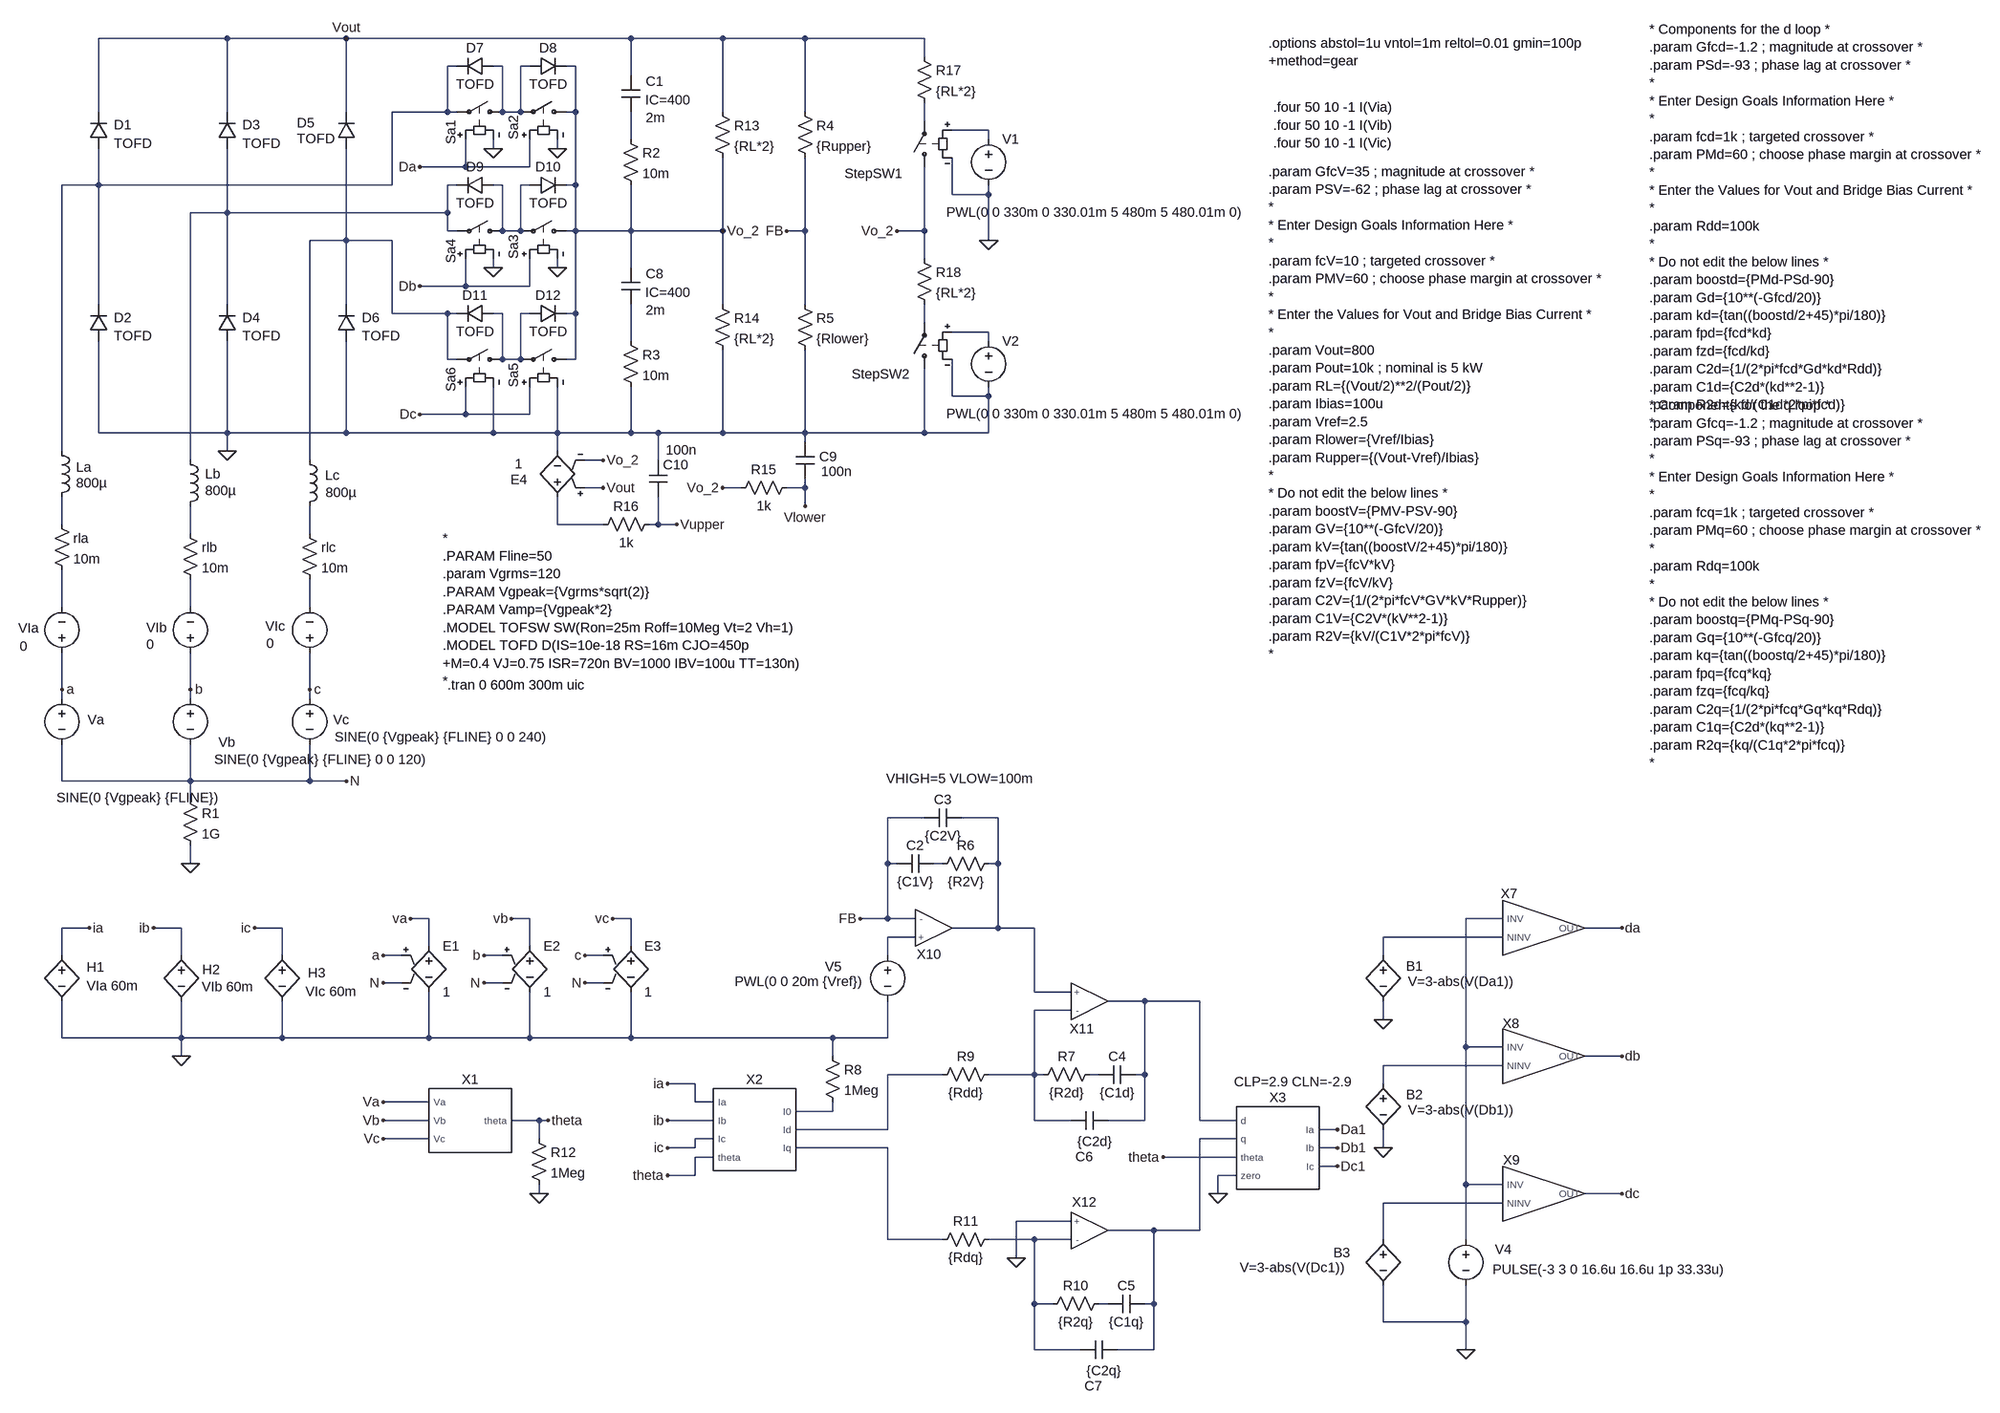
[diagram p0: schematic 3-phase Vienna PFC with switches - load step.asc]
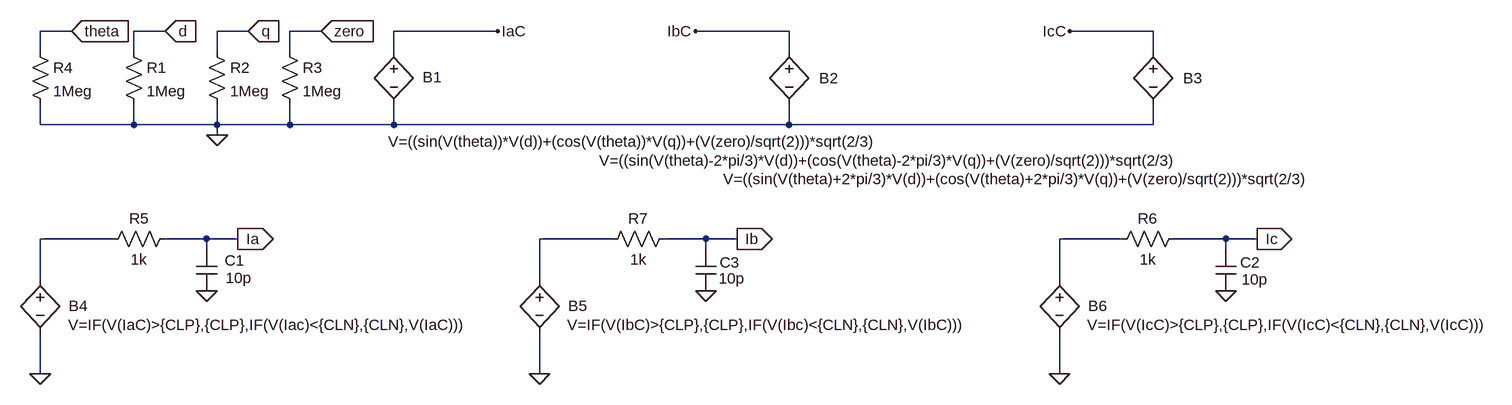
[diagram p1: sub-circuit inverse_dq0.asc]
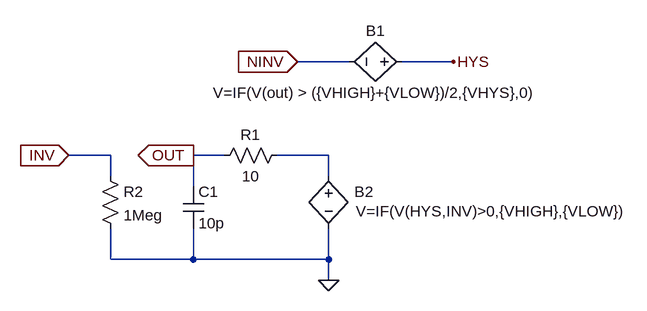
[diagram p2: sub-circuit comptof.asc]
3-phase Vienna PFC with switches - load step.asc, the LTspice schematic file:
Version 4
SHEET 1 4316 2068
WIRE 464 -960 240 -960
WIRE 672 -960 464 -960
WIRE 1168 -960 672 -960
WIRE 1328 -960 1168 -960
WIRE 1472 -960 1328 -960
WIRE 1680 -960 1472 -960
WIRE 1680 -928 1680 -960
WIRE 864 -912 848 -912
WIRE 944 -912 928 -912
WIRE 992 -912 976 -912
WIRE 1072 -912 1056 -912
WIRE 1168 -896 1168 -960
WIRE 240 -832 240 -960
WIRE 464 -832 464 -960
WIRE 672 -832 672 -960
WIRE 848 -832 848 -912
WIRE 848 -832 752 -832
WIRE 864 -832 848 -832
WIRE 944 -832 944 -912
WIRE 976 -832 976 -912
WIRE 976 -832 944 -832
WIRE 1072 -832 1072 -912
WIRE 1072 -832 1056 -832
WIRE 1328 -832 1328 -960
WIRE 1472 -832 1472 -960
WIRE 1680 -816 1680 -848
WIRE 1792 -800 1728 -800
WIRE 1168 -784 1168 -832
WIRE 1792 -784 1792 -800
WIRE 928 -768 928 -784
WIRE 1040 -768 1040 -784
WIRE 880 -736 880 -784
WIRE 880 -736 800 -736
WIRE 992 -736 992 -784
WIRE 992 -736 880 -736
WIRE 240 -704 240 -768
WIRE 240 -704 176 -704
WIRE 752 -704 752 -832
WIRE 752 -704 240 -704
WIRE 864 -704 848 -704
WIRE 944 -704 928 -704
WIRE 992 -704 976 -704
WIRE 1072 -704 1072 -832
WIRE 1072 -704 1056 -704
WIRE 1728 -688 1728 -752
WIRE 1792 -688 1792 -704
WIRE 1792 -688 1728 -688
WIRE 464 -656 464 -768
WIRE 464 -656 400 -656
WIRE 848 -656 848 -704
WIRE 848 -656 464 -656
WIRE 848 -624 848 -656
WIRE 864 -624 848 -624
WIRE 944 -624 944 -704
WIRE 976 -624 976 -704
WIRE 976 -624 944 -624
WIRE 1072 -624 1072 -704
WIRE 1072 -624 1056 -624
WIRE 1168 -624 1168 -704
WIRE 1168 -624 1072 -624
WIRE 1328 -624 1328 -752
WIRE 1328 -624 1168 -624
WIRE 1472 -624 1472 -752
WIRE 1472 -624 1440 -624
WIRE 1680 -624 1680 -736
WIRE 1680 -624 1632 -624
WIRE 672 -608 672 -768
WIRE 672 -608 608 -608
WIRE 752 -608 672 -608
WIRE 1792 -608 1792 -688
WIRE 1680 -576 1680 -624
WIRE 928 -560 928 -576
WIRE 1040 -560 1040 -576
WIRE 1168 -560 1168 -624
WIRE 880 -528 880 -576
WIRE 880 -528 800 -528
WIRE 992 -528 992 -576
WIRE 992 -528 880 -528
WIRE 240 -496 240 -704
WIRE 464 -496 464 -656
WIRE 672 -496 672 -608
WIRE 1328 -496 1328 -624
WIRE 1472 -496 1472 -624
WIRE 752 -480 752 -608
WIRE 848 -480 752 -480
WIRE 864 -480 848 -480
WIRE 944 -480 928 -480
WIRE 992 -480 976 -480
WIRE 1072 -480 1072 -624
WIRE 1072 -480 1056 -480
WIRE 1680 -464 1680 -496
WIRE 1792 -448 1728 -448
WIRE 1168 -432 1168 -496
WIRE 1792 -432 1792 -448
WIRE 848 -400 848 -480
WIRE 864 -400 848 -400
WIRE 944 -400 944 -480
WIRE 976 -400 976 -480
WIRE 976 -400 944 -400
WIRE 1072 -400 1072 -480
WIRE 1072 -400 1056 -400
WIRE 1728 -336 1728 -400
WIRE 1792 -336 1792 -352
WIRE 1792 -336 1728 -336
WIRE 880 -304 880 -352
WIRE 880 -304 800 -304
WIRE 992 -304 992 -352
WIRE 992 -304 880 -304
WIRE 240 -272 240 -432
WIRE 464 -272 464 -432
WIRE 464 -272 240 -272
WIRE 672 -272 672 -432
WIRE 672 -272 464 -272
WIRE 928 -272 928 -352
WIRE 928 -272 672 -272
WIRE 1040 -272 1040 -352
WIRE 1040 -272 928 -272
WIRE 1168 -272 1168 -352
WIRE 1168 -272 1040 -272
WIRE 1216 -272 1168 -272
WIRE 1328 -272 1328 -416
WIRE 1328 -272 1216 -272
WIRE 1472 -272 1472 -416
WIRE 1472 -272 1328 -272
WIRE 1680 -272 1680 -384
WIRE 1680 -272 1472 -272
WIRE 1792 -272 1792 -336
WIRE 1792 -272 1680 -272
WIRE 1472 -256 1472 -272
WIRE 176 -240 176 -704
WIRE 464 -240 464 -272
WIRE 1040 -240 1040 -272
WIRE 400 -224 400 -656
WIRE 608 -224 608 -608
WIRE 1120 -224 1088 -224
WIRE 1216 -224 1216 -272
WIRE 1120 -176 1088 -176
WIRE 1360 -176 1328 -176
WIRE 1472 -176 1472 -192
WIRE 1472 -176 1440 -176
WIRE 1472 -144 1472 -176
WIRE 176 -112 176 -160
WIRE 1040 -112 1040 -160
WIRE 1120 -112 1040 -112
WIRE 1216 -112 1216 -160
WIRE 1216 -112 1200 -112
WIRE 1248 -112 1216 -112
WIRE 400 -96 400 -144
WIRE 608 -96 608 -144
WIRE 176 32 176 -32
WIRE 400 32 400 -16
WIRE 608 32 608 -16
WIRE 176 176 176 112
WIRE 400 176 400 112
WIRE 608 176 608 112
WIRE 176 192 176 176
WIRE 400 192 400 176
WIRE 608 192 608 176
WIRE 176 336 176 272
WIRE 400 336 400 272
WIRE 400 336 176 336
WIRE 608 336 608 272
WIRE 608 336 400 336
WIRE 672 336 608 336
WIRE 400 368 400 336
WIRE 1680 400 1616 400
WIRE 1808 400 1744 400
WIRE 400 480 400 448
WIRE 1616 480 1616 400
WIRE 1632 480 1616 480
WIRE 1712 480 1696 480
WIRE 1808 480 1808 400
WIRE 1808 480 1792 480
WIRE 816 576 784 576
WIRE 992 576 960 576
WIRE 1168 576 1136 576
WIRE 1616 576 1616 480
WIRE 1616 576 1568 576
WIRE 1664 576 1616 576
WIRE 2688 576 2624 576
WIRE 224 592 176 592
WIRE 384 592 336 592
WIRE 560 592 512 592
WIRE 1808 592 1808 480
WIRE 1808 592 1728 592
WIRE 1872 592 1808 592
WIRE 2896 592 2832 592
WIRE 1664 608 1616 608
WIRE 2688 608 2480 608
WIRE 816 624 816 576
WIRE 992 624 992 576
WIRE 1168 624 1168 576
WIRE 176 640 176 592
WIRE 384 640 384 592
WIRE 560 640 560 592
WIRE 768 640 736 640
WIRE 944 640 912 640
WIRE 1120 640 1088 640
WIRE 1616 640 1616 608
WIRE 2480 640 2480 608
WIRE 768 688 736 688
WIRE 944 688 912 688
WIRE 1120 688 1088 688
WIRE 1872 704 1872 592
WIRE 1936 704 1872 704
WIRE 2064 720 2000 720
WIRE 2160 720 2064 720
WIRE 1936 736 1872 736
WIRE 2480 752 2480 720
WIRE 176 784 176 720
WIRE 384 784 384 720
WIRE 384 784 176 784
WIRE 560 784 560 720
WIRE 560 784 384 784
WIRE 816 784 816 704
WIRE 816 784 560 784
WIRE 992 784 992 704
WIRE 992 784 816 784
WIRE 1168 784 1168 704
WIRE 1168 784 992 784
WIRE 1520 784 1168 784
WIRE 1616 784 1616 720
WIRE 1616 784 1520 784
WIRE 2624 800 2624 576
WIRE 2688 800 2624 800
WIRE 384 816 384 784
WIRE 1520 816 1520 784
WIRE 2896 816 2832 816
WIRE 2688 832 2480 832
WIRE 1712 848 1616 848
WIRE 1872 848 1872 736
WIRE 1872 848 1792 848
WIRE 1888 848 1872 848
WIRE 1984 848 1968 848
WIRE 2064 848 2064 720
WIRE 2064 848 2048 848
WIRE 1280 864 1232 864
WIRE 2480 864 2480 832
WIRE 816 896 736 896
WIRE 1280 896 1280 864
WIRE 1312 896 1280 896
WIRE 1520 912 1520 896
WIRE 1520 912 1456 912
WIRE 816 928 736 928
WIRE 1008 928 960 928
WIRE 1024 928 1008 928
WIRE 1312 928 1232 928
WIRE 1872 928 1872 848
WIRE 1936 928 1872 928
WIRE 2064 928 2064 848
WIRE 2064 928 2000 928
WIRE 2160 928 2160 720
WIRE 2224 928 2160 928
WIRE 1616 944 1616 848
WIRE 1616 944 1456 944
WIRE 2400 944 2368 944
WIRE 816 960 736 960
WIRE 1008 960 1008 928
WIRE 1312 960 1280 960
WIRE 2224 960 2160 960
WIRE 1280 976 1280 960
WIRE 1280 976 1232 976
WIRE 1616 976 1456 976
WIRE 2400 976 2368 976
WIRE 2480 976 2480 944
WIRE 1312 992 1280 992
WIRE 2224 992 2096 992
WIRE 2400 1008 2368 1008
WIRE 1280 1024 1280 992
WIRE 1280 1024 1232 1024
WIRE 2224 1024 2192 1024
WIRE 2624 1040 2624 800
WIRE 2688 1040 2624 1040
WIRE 1008 1056 1008 1040
WIRE 2192 1056 2192 1024
WIRE 2896 1056 2832 1056
WIRE 2688 1072 2480 1072
WIRE 1936 1104 1840 1104
WIRE 2080 1120 2000 1120
WIRE 2160 1120 2160 960
WIRE 2160 1120 2080 1120
WIRE 1616 1136 1616 976
WIRE 1712 1136 1616 1136
WIRE 1872 1136 1792 1136
WIRE 1936 1136 1872 1136
WIRE 2480 1136 2480 1072
WIRE 2624 1136 2624 1040
WIRE 1840 1168 1840 1104
WIRE 1872 1248 1872 1136
WIRE 1904 1248 1872 1248
WIRE 2000 1248 1984 1248
WIRE 2080 1248 2080 1120
WIRE 2080 1248 2064 1248
WIRE 2480 1280 2480 1216
WIRE 2624 1280 2624 1216
WIRE 2624 1280 2480 1280
WIRE 1872 1328 1872 1248
WIRE 1952 1328 1872 1328
WIRE 2080 1328 2080 1248
WIRE 2080 1328 2016 1328
WIRE 2624 1328 2624 1280
FLAG 400 480 0
FLAG 224 592 ia
FLAG 336 592 ib
FLAG 512 592 ic
FLAG 176 176 a
FLAG 400 176 b
FLAG 608 176 c
FLAG 384 816 0
FLAG 1440 -624 FB
FLAG 672 -960 Vout
FLAG 784 576 va
FLAG 672 336 N
FLAG 736 688 N
FLAG 736 640 a
FLAG 960 576 vb
FLAG 912 688 N
FLAG 912 640 b
FLAG 1136 576 vc
FLAG 1088 688 N
FLAG 1088 640 c
FLAG 464 -240 0
FLAG 1024 928 theta
FLAG 736 896 Va
FLAG 736 928 Vb
FLAG 736 960 Vc
FLAG 1232 864 ia
FLAG 1232 928 ib
FLAG 1232 976 ic
FLAG 1232 1024 theta
FLAG 1568 576 FB
FLAG 1840 1168 0
FLAG 2096 992 theta
FLAG 2192 1056 0
FLAG 2624 1328 0
FLAG 2896 592 da
FLAG 2896 816 db
FLAG 2896 1056 dc
FLAG 1008 1056 0
FLAG 928 -768 0
FLAG 1040 -768 0
FLAG 1040 -560 0
FLAG 928 -560 0
FLAG 800 -304 Dc
FLAG 800 -528 Db
FLAG 800 -736 Da
FLAG 1328 -624 Vo_2
FLAG 2400 944 Da1
FLAG 2400 976 Db1
FLAG 2400 1008 Dc1
FLAG 2480 752 0
FLAG 2480 976 0
FLAG 1328 -176 Vo_2
FLAG 1472 -144 Vlower
FLAG 1120 -224 Vo_2
FLAG 1120 -176 Vout
FLAG 1248 -112 Vupper
FLAG 1632 -624 Vo_2
FLAG 1792 -608 0
SYMBOL voltage 176 176 R0
WINDOW 0 45 53 Left 2
WINDOW 3 -9 189 Left 2
WINDOW 123 0 0 Left 0
WINDOW 39 0 0 Left 0
SYMATTR InstName Va
SYMATTR Value SINE(0 {Vgpeak} {FLINE})
SYMBOL voltage 400 176 R0
WINDOW 0 49 92 Left 2
WINDOW 3 42 122 Left 2
WINDOW 123 0 0 Left 0
WINDOW 39 0 0 Left 0
SYMATTR InstName Vb
SYMATTR Value SINE(0 {Vgpeak} {FLINE} 0 0 120)
SYMBOL voltage 608 176 R0
WINDOW 0 41 53 Left 2
WINDOW 3 44 83 Left 2
WINDOW 123 0 0 Left 0
WINDOW 39 0 0 Left 0
SYMATTR InstName Vc
SYMATTR Value SINE(0 {Vgpeak} {FLINE} 0 0 240)
SYMBOL res 384 352 R0
SYMATTR InstName R1
SYMATTR Value 1G
SYMBOL res 160 -128 R0
SYMATTR InstName rla
SYMATTR Value 10m
SYMBOL res 384 -112 R0
SYMATTR InstName rlb
SYMATTR Value 10m
SYMBOL res 592 -112 R0
SYMATTR InstName rlc
SYMATTR Value 10m
SYMBOL h 176 624 R0
WINDOW 0 43 37 Left 2
WINDOW 3 43 69 Left 2
SYMATTR InstName H1
SYMATTR Value VIa 60m
SYMBOL h 384 624 R0
WINDOW 0 37 41 Left 2
WINDOW 3 36 71 Left 2
SYMATTR InstName H2
SYMATTR Value VIb 60m
SYMBOL h 560 624 R0
WINDOW 0 45 47 Left 2
WINDOW 3 41 79 Left 2
SYMATTR InstName H3
SYMATTR Value VIc 60m
SYMBOL ind 160 -256 R0
WINDOW 0 41 44 Left 2
WINDOW 3 41 72 Left 2
SYMATTR InstName La
SYMATTR Value 800µ
SYMBOL ind 384 -240 R0
WINDOW 0 42 40 Left 2
WINDOW 3 42 69 Left 2
SYMATTR InstName Lb
SYMATTR Value 800µ
SYMBOL ind 592 -240 R0
WINDOW 0 43 42 Left 2
WINDOW 3 44 72 Left 2
SYMATTR InstName Lc
SYMATTR Value 800µ
SYMBOL voltage 176 128 R180
WINDOW 0 40 59 Left 2
WINDOW 3 60 27 Left 2
WINDOW 123 0 0 Left 0
WINDOW 39 0 0 Left 0
SYMATTR InstName VIa
SYMATTR Value 0
SYMBOL voltage 400 128 R180
WINDOW 0 41 60 Left 2
WINDOW 3 63 31 Left 2
WINDOW 123 0 0 Left 0
WINDOW 39 0 0 Left 0
SYMATTR InstName VIb
SYMATTR Value 0
SYMBOL voltage 608 128 R180
WINDOW 0 43 62 Left 2
WINDOW 3 62 32 Left 2
WINDOW 123 0 0 Left 0
WINDOW 39 0 0 Left 0
SYMATTR InstName VIc
SYMATTR Value 0
SYMBOL sw 1072 -832 M270
WINDOW 3 47 44 Invisible 2
WINDOW 0 -49 108 Left 2
SYMATTR Value TOFSW
SYMATTR InstName Sa2
SYMBOL sw 960 -832 M270
WINDOW 3 41 43 Invisible 2
WINDOW 0 -57 105 Left 2
SYMATTR Value TOFSW
SYMATTR InstName Sa1
SYMBOL cap 1152 -896 R0
WINDOW 0 42 11 Left 2
WINDOW 3 42 74 Left 2
WINDOW 123 41 43 Left 2
SYMATTR InstName C1
SYMATTR Value 2m
SYMATTR Value2 IC=400
SYMBOL res 1152 -800 R0
SYMATTR InstName R2
SYMATTR Value 10m
SYMBOL res 1456 -848 R0
SYMATTR InstName R4
SYMATTR Value {Rupper}
SYMBOL res 1456 -512 R0
SYMATTR InstName R5
SYMATTR Value {Rlower}
SYMBOL e 816 608 R0
SYMATTR InstName E1
SYMATTR Value 1
SYMBOL e 992 608 R0
SYMATTR InstName E2
SYMATTR Value 1
SYMBOL e 1168 608 R0
SYMATTR InstName E3
SYMATTR Value 1
SYMBOL theta_sub 880 928 R0
SYMATTR InstName X1
SYMBOL dq0_sub 1376 944 R0
SYMATTR InstName X2
SYMBOL res 1808 464 R90
WINDOW 0 0 56 VBottom 2
WINDOW 3 32 56 VTop 2
SYMATTR InstName R6
SYMATTR Value {R2V}
SYMBOL cap 1696 464 R90
WINDOW 0 0 32 VBottom 2
WINDOW 3 32 32 VTop 2
SYMATTR InstName C2
SYMATTR Value {C1V}
SYMBOL cap 1744 384 R90
WINDOW 0 0 32 VBottom 2
WINDOW 3 32 32 VTop 2
SYMATTR InstName C3
SYMATTR Value {C2V}
SYMBOL res 1872 864 R270
WINDOW 0 32 56 VTop 2
WINDOW 3 0 56 VBottom 2
SYMATTR InstName R7
SYMATTR Value {R2d}
SYMBOL cap 1984 864 R270
WINDOW 0 32 32 VTop 2
WINDOW 3 0 32 VBottom 2
SYMATTR InstName C4
SYMATTR Value {C1d}
SYMBOL cap 1936 944 R270
WINDOW 0 -63 23 VTop 2
WINDOW 3 -5 41 VBottom 2
SYMATTR InstName C6
SYMATTR Value {C2d}
SYMBOL res 1504 800 R0
SYMATTR InstName R8
SYMATTR Value 1Meg
SYMBOL res 1808 832 R90
WINDOW 0 0 56 VBottom 2
WINDOW 3 32 56 VTop 2
SYMATTR InstName R9
SYMATTR Value {Rdd}
SYMBOL res 1888 1264 R270
WINDOW 0 32 56 VTop 2
WINDOW 3 0 56 VBottom 2
SYMATTR InstName R10
SYMATTR Value {R2q}
SYMBOL cap 2000 1264 R270
WINDOW 0 32 32 VTop 2
WINDOW 3 0 32 VBottom 2
SYMATTR InstName C5
SYMATTR Value {C1q}
SYMBOL cap 1952 1344 R270
WINDOW 0 -63 23 VTop 2
WINDOW 3 -5 41 VBottom 2
SYMATTR InstName C7
SYMATTR Value {C2q}
SYMBOL res 1808 1120 R90
WINDOW 0 0 56 VBottom 2
WINDOW 3 32 56 VTop 2
SYMATTR InstName R11
SYMATTR Value {Rdq}
SYMBOL Inverse_dq0 2288 976 R0
WINDOW 39 35 -100 Bottom 2
SYMATTR SpiceLine CLP=2.9 CLN=-2.9
SYMATTR InstName X3
SYMBOL voltage 2624 1120 R0
WINDOW 123 0 0 Left 0
WINDOW 39 0 0 Left 0
WINDOW 0 51 33 Left 2
WINDOW 3 47 68 Left 2
SYMATTR InstName V4
SYMATTR Value PULSE(-3 3 0 16.6u 16.6u 1p 33.33u)
SYMBOL res 992 944 R0
SYMATTR InstName R12
SYMATTR Value 1Meg
SYMBOL COMPTOF 2752 592 R0
WINDOW 0 -52 -44 Bottom 2
SYMATTR InstName X7
SYMATTR SpiceLine VHIGH=5 VLOW=100m VHYS=10m
SYMBOL COMPTOF 2752 816 R0
WINDOW 0 -49 -41 Bottom 2
SYMATTR InstName X8
SYMATTR SpiceLine VHIGH=5 VLOW=100m VHYS=10m
SYMBOL COMPTOF 2752 1056 R0
WINDOW 0 -48 -43 Bottom 2
SYMATTR InstName X9
SYMATTR SpiceLine VHIGH=5 VLOW=100m VHYS=10m
SYMBOL opampTOF 1728 576 R0
WINDOW 0 -40 78 Bottom 2
WINDOW 39 13 -229 Bottom 2
SYMATTR InstName X10
SYMATTR SpiceLine VHIGH=5 VLOW=100m
SYMBOL opampTOF 2000 736 M180
WINDOW 0 -45 -17 Bottom 2
SYMATTR InstName X11
SYMATTR SpiceLine VHIGH=5 VLOW=-5
SYMBOL opampTOF 2000 1136 M180
WINDOW 0 -41 81 Bottom 2
SYMATTR InstName X12
SYMATTR SpiceLine VHIGH=5 VLOW=-5
SYMBOL res 1312 -848 R0
SYMATTR InstName R13
SYMATTR Value {RL*2}
SYMBOL diode 224 -768 M180
WINDOW 0 43 41 Left 2
WINDOW 3 43 9 Left 2
SYMATTR InstName D1
SYMATTR Value TOFD
SYMBOL diode 224 -432 M180
WINDOW 0 43 41 Left 2
WINDOW 3 43 9 Left 2
SYMATTR InstName D2
SYMATTR Value TOFD
SYMBOL diode 448 -768 M180
WINDOW 0 43 41 Left 2
WINDOW 3 43 9 Left 2
SYMATTR InstName D3
SYMATTR Value TOFD
SYMBOL diode 448 -432 M180
WINDOW 0 43 41 Left 2
WINDOW 3 43 9 Left 2
SYMATTR InstName D4
SYMATTR Value TOFD
SYMBOL diode 656 -768 M180
WINDOW 0 -70 45 Left 2
WINDOW 3 -70 17 Left 2
SYMATTR InstName D5
SYMATTR Value TOFD
SYMBOL diode 656 -432 M180
WINDOW 0 43 41 Left 2
WINDOW 3 43 9 Left 2
SYMATTR InstName D6
SYMATTR Value TOFD
SYMBOL diode 928 -896 M270
WINDOW 0 32 32 VTop 2
WINDOW 3 0 32 VBottom 2
SYMATTR InstName D7
SYMATTR Value TOFD
SYMBOL diode 992 -928 M90
WINDOW 0 0 32 VBottom 2
WINDOW 3 32 32 VTop 2
SYMATTR InstName D8
SYMATTR Value TOFD
SYMBOL sw 1072 -624 M270
WINDOW 3 47 44 Invisible 2
WINDOW 0 -49 108 Left 2
SYMATTR Value TOFSW
SYMATTR InstName Sa3
SYMBOL sw 960 -624 M270
WINDOW 3 41 43 Invisible 2
WINDOW 0 -57 105 Left 2
SYMATTR Value TOFSW
SYMATTR InstName Sa4
SYMBOL diode 928 -688 M270
WINDOW 0 32 32 VTop 2
WINDOW 3 0 32 VBottom 2
SYMATTR InstName D9
SYMATTR Value TOFD
SYMBOL diode 992 -720 M90
WINDOW 0 0 32 VBottom 2
WINDOW 3 32 32 VTop 2
SYMATTR InstName D10
SYMATTR Value TOFD
SYMBOL sw 1072 -400 M270
WINDOW 3 47 44 Invisible 2
WINDOW 0 -49 108 Left 2
SYMATTR Value TOFSW
SYMATTR InstName Sa5
SYMBOL sw 960 -400 M270
WINDOW 3 41 43 Invisible 2
WINDOW 0 -57 105 Left 2
SYMATTR Value TOFSW
SYMATTR InstName Sa6
SYMBOL diode 928 -464 M270
WINDOW 0 32 32 VTop 2
WINDOW 3 0 32 VBottom 2
SYMATTR InstName D11
SYMATTR Value TOFD
SYMBOL diode 992 -496 M90
WINDOW 0 0 32 VBottom 2
WINDOW 3 32 32 VTop 2
SYMATTR InstName D12
SYMATTR Value TOFD
SYMBOL cap 1152 -560 R0
WINDOW 0 42 11 Left 2
WINDOW 3 42 74 Left 2
WINDOW 123 41 43 Left 2
SYMATTR InstName C8
SYMATTR Value 2m
SYMATTR Value2 IC=400
SYMBOL res 1152 -448 R0
SYMATTR InstName R3
SYMATTR Value 10m
SYMBOL res 1312 -512 R0
SYMATTR InstName R14
SYMATTR Value {RL*2}
SYMBOL bv 2480 624 R0
WINDOW 0 40 35 Left 2
WINDOW 3 43 62 Left 2
SYMATTR InstName B1
SYMATTR Value V=3-abs(V(Da1))
SYMBOL bv 2480 848 R0
WINDOW 0 40 35 Left 2
WINDOW 3 43 62 Left 2
SYMATTR InstName B2
SYMATTR Value V=3-abs(V(Db1))
SYMBOL bv 2480 1120 R0
WINDOW 0 -87 39 Left 2
WINDOW 3 -250 65 Left 2
SYMATTR InstName B3
SYMATTR Value V=3-abs(V(Dc1))
SYMBOL e 1040 -144 R180
WINDOW 0 52 46 Left 2
WINDOW 3 61 74 Left 2
SYMATTR InstName E4
SYMATTR Value 1
SYMBOL res 1456 -192 R90
WINDOW 0 0 56 VBottom 2
WINDOW 3 32 56 VTop 2
SYMATTR InstName R15
SYMATTR Value 1k
SYMBOL cap 1456 -256 R0
WINDOW 0 41 26 Left 2
WINDOW 3 44 52 Left 2
SYMATTR InstName C9
SYMATTR Value 100n
SYMBOL res 1216 -128 R90
WINDOW 0 0 56 VBottom 2
WINDOW 3 32 56 VTop 2
SYMATTR InstName R16
SYMATTR Value 1k
SYMBOL cap 1200 -224 R0
WINDOW 3 29 -18 Left 2
SYMATTR Value 100n
SYMATTR InstName C10
SYMBOL sw 1680 -720 R180
WINDOW 3 47 44 Invisible 2
WINDOW 0 38 4 Left 2
SYMATTR Value TOFSW
SYMATTR InstName StepSW1
SYMBOL res 1664 -944 R0
SYMATTR InstName R17
SYMATTR Value {RL*2}
SYMBOL voltage 1792 -800 R0
WINDOW 3 -74 143 Left 2
WINDOW 123 0 0 Left 0
WINDOW 39 0 0 Left 0
SYMATTR Value PWL(0 0 330m 0 330.01m 5 480m 5 480.01m 0)
SYMATTR InstName V1
SYMBOL sw 1680 -368 R180
WINDOW 3 47 44 Invisible 2
WINDOW 0 25 6 Left 2
SYMATTR Value TOFSW
SYMATTR InstName StepSW2
SYMBOL res 1664 -592 R0
SYMATTR InstName R18
SYMATTR Value {RL*2}
SYMBOL voltage 1792 -448 R0
WINDOW 3 -74 143 Left 2
WINDOW 123 0 0 Left 0
WINDOW 39 0 0 Left 0
SYMATTR Value PWL(0 0 330m 0 330.01m 5 480m 5 480.01m 0)
SYMATTR InstName V2
SYMBOL voltage 1616 624 M0
WINDOW 0 80 36 Left 2
WINDOW 3 43 62 Left 2
WINDOW 123 0 0 Left 0
WINDOW 39 0 0 Left 0
SYMATTR InstName V5
SYMATTR Value PWL(0 0 20m {Vref})
TEXT 840 -88 Left 2 !*\n.PARAM Fline=50\n.param Vgrms=120\n.PARAM Vgpeak={Vgrms*sqrt(2)}\n.PARAM Vamp={Vgpeak*2}\n.MODEL TOFSW SW(Ron=25m Roff=10Meg Vt=2 Vh=1)\n.MODEL TOFD D(IS=10e-18 RS=16m CJO=450p \n+M=0.4 VJ=0.75 ISR=720n BV=1000 IBV=100u TT=130n)\n*
TEXT 848 168 Left 2 !.tran 0 600m 300m uic
TEXT 2280 -728 Left 2 !.param GfcV=35 ; magnitude at crossover *\n.param PSV=-62 ; phase lag at crossover *\n*\n* Enter Design Goals Information Here *\n*\n.param fcV=10 ; targeted crossover *\n.param PMV=60 ; choose phase margin at crossover *\n*\n* Enter the Values for Vout and Bridge Bias Current *\n*\n.param Vout=800\n.param Pout=10k ; nominal is 5 kW\n.param RL={(Vout/2)**2/(Pout/2)}\n.param Ibias=100u\n.param Vref=2.5\n.param Rlower={Vref/Ibias}\n.param Rupper={(Vout-Vref)/Ibias}\n*\n* Do not edit the below lines *\n.param boostV={PMV-PSV-90}\n.param GV={10**(-GfcV/20)}\n.param kV={tan((boostV/2+45)*pi/180)}\n.param fpV={fcV*kV}\n.param fzV={fcV/kV}\n.param C2V={1/(2*pi*fcV*GV*kV*Rupper)}\n.param C1V={C2V*(kV**2-1)}\n.param R2V={kV/(C1V*2*pi*fcV)}\n*
TEXT 2944 -976 Left 2 !* Components for the d loop *\n.param Gfcd=-1.2 ; magnitude at crossover *\n.param PSd=-93 ; phase lag at crossover *\n*\n* Enter Design Goals Information Here *\n*\n.param fcd=1k ; targeted crossover *\n.param PMd=60 ; choose phase margin at crossover *\n*\n* Enter the Values for Vout and Bridge Bias Current *\n*\n.param Rdd=100k\n*\n* Do not edit the below lines *\n.param boostd={PMd-PSd-90}\n.param Gd={10**(-Gfcd/20)}\n.param kd={tan((boostd/2+45)*pi/180)}\n.param fpd={fcd*kd}\n.param fzd={fcd/kd}\n.param C2d={1/(2*pi*fcd*Gd*kd*Rdd)}\n.param C1d={C2d*(kd**2-1)}\n.param R2d={kd/(C1d*2*pi*fcd)}\n*
TEXT 2944 -320 Left 2 !* Components for the q loop *\n.param Gfcq=-1.2 ; magnitude at crossover *\n.param PSq=-93 ; phase lag at crossover *\n*\n* Enter Design Goals Information Here *\n*\n.param fcq=1k ; targeted crossover *\n.param PMq=60 ; choose phase margin at crossover *\n*\n.param Rdq=100k\n*\n* Do not edit the below lines *\n.param boostq={PMq-PSq-90}\n.param Gq={10**(-Gfcq/20)}\n.param kq={tan((boostq/2+45)*pi/180)}\n.param fpq={fcq*kq}\n.param fzq={fcq/kq}\n.param C2q={1/(2*pi*fcq*Gq*kq*Rdq)}\n.param C1q={C2d*(kq**2-1)}\n.param R2q={kq/(C1q*2*pi*fcq)}\n*
TEXT 2288 -840 Left 2 !.four 50 10 -1 I(Via)\n.four 50 10 -1 I(Vib)\n.four 50 10 -1 I(Vic)
TEXT 2280 -952 Left 2 !.options abstol=1u vntol=1m reltol=0.01 gmin=100p\n+method=gear

inverse_dq0.asc, the sub-circuit schematic file:
Version 4
SHEET 1 1804 980
WIRE -464 16 -512 16
WIRE -320 16 -368 16
WIRE -192 16 -240 16
WIRE -80 16 -128 16
WIRE 192 16 32 16
WIRE 640 16 496 16
WIRE 1200 16 1072 16
WIRE -512 48 -512 16
WIRE -368 48 -368 16
WIRE -240 48 -240 16
WIRE -128 48 -128 16
WIRE 32 48 32 16
WIRE 640 48 640 16
WIRE 1200 48 1200 16
WIRE -512 160 -512 128
WIRE -368 160 -368 128
WIRE -368 160 -512 160
WIRE -240 160 -240 128
WIRE -240 160 -368 160
WIRE -128 160 -128 128
WIRE -128 160 -240 160
WIRE 32 160 32 128
WIRE 32 160 -128 160
WIRE 640 160 640 128
WIRE 640 160 32 160
WIRE 1200 160 1200 128
WIRE 1200 160 640 160
WIRE -240 176 -240 160
WIRE -400 336 -512 336
WIRE -256 336 -320 336
WIRE -208 336 -256 336
WIRE 368 336 256 336
WIRE 512 336 448 336
WIRE 560 336 512 336
WIRE 1152 336 1056 336
WIRE 1312 336 1232 336
WIRE 1360 336 1312 336
WIRE -256 352 -256 336
WIRE 512 352 512 336
WIRE 1312 352 1312 336
WIRE -512 400 -512 336
WIRE 256 400 256 336
WIRE 1056 400 1056 336
WIRE -512 544 -512 480
WIRE 256 544 256 480
WIRE 1056 544 1056 480
FLAG -240 176 0
FLAG -320 16 d
IOPIN -320 16 In
FLAG -192 16 q
IOPIN -192 16 In
FLAG -80 16 zero
IOPIN -80 16 In
FLAG 192 16 IaC
FLAG 496 16 IbC
FLAG 1072 16 IcC
FLAG -464 16 theta
IOPIN -464 16 In
FLAG -208 336 Ia
IOPIN -208 336 Out
FLAG -512 544 0
FLAG 560 336 Ib
IOPIN 560 336 Out
FLAG 256 544 0
FLAG 1360 336 Ic
IOPIN 1360 336 Out
FLAG 1056 544 0
FLAG -256 416 0
FLAG 1312 416 0
FLAG 512 416 0
SYMBOL res -384 32 R0
SYMATTR InstName R1
SYMATTR Value 1Meg
SYMBOL res -256 32 R0
SYMATTR InstName R2
SYMATTR Value 1Meg
SYMBOL res -144 32 R0
SYMATTR InstName R3
SYMATTR Value 1Meg
SYMBOL bv 32 32 R0
WINDOW 0 44 55 Left 2
WINDOW 3 -9 154 Left 2
SYMATTR InstName B1
SYMATTR Value V=((sin(V(theta))*V(d))+(cos(V(theta))*V(q))+(V(zero)/sqrt(2)))*sqrt(2/3)
SYMBOL bv 640 32 R0
WINDOW 0 46 56 Left 2
WINDOW 3 -292 183 Left 2
SYMATTR InstName B2
SYMATTR Value V=((sin(V(theta)-2*pi/3)*V(d))+(cos(V(theta)-2*pi/3)*V(q))+(V(zero)/sqrt(2)))*sqrt(2/3)
SYMBOL res -528 32 R0
SYMATTR InstName R4
SYMATTR Value 1Meg
SYMBOL bv 1200 32 R0
WINDOW 0 46 56 Left 2
WINDOW 3 -661 212 Left 2
SYMATTR InstName B3
SYMATTR Value V=((sin(V(theta)+2*pi/3)*V(d))+(cos(V(theta)+2*pi/3)*V(q))+(V(zero)/sqrt(2)))*sqrt(2/3)
SYMBOL bv -512 384 R0
WINDOW 0 44 55 Left 2
WINDOW 3 43 84 Left 2
SYMATTR InstName B4
SYMATTR Value V=IF(V(IaC)>{CLP},{CLP},IF(V(Iac)<{CLN},{CLN},V(IaC)))
SYMBOL bv 256 384 R0
WINDOW 0 44 55 Left 2
WINDOW 3 43 84 Left 2
SYMATTR InstName B5
SYMATTR Value V=IF(V(IbC)>{CLP},{CLP},IF(V(Ibc)<{CLN},{CLN},V(IbC)))
SYMBOL bv 1056 384 R0
WINDOW 0 44 55 Left 2
WINDOW 3 43 84 Left 2
SYMATTR InstName B6
SYMATTR Value V=IF(V(IcC)>{CLP},{CLP},IF(V(IcC)<{CLN},{CLN},V(IcC)))
SYMBOL res -304 320 R90
WINDOW 0 0 56 VBottom 2
WINDOW 3 32 56 VTop 2
SYMATTR InstName R5
SYMATTR Value 1k
SYMBOL res 1248 320 R90
WINDOW 0 0 56 VBottom 2
WINDOW 3 32 56 VTop 2
SYMATTR InstName R6
SYMATTR Value 1k
SYMBOL res 464 320 R90
WINDOW 0 0 56 VBottom 2
WINDOW 3 32 56 VTop 2
SYMATTR InstName R7
SYMATTR Value 1k
SYMBOL cap -272 352 R0
WINDOW 0 44 17 Left 2
WINDOW 3 45 44 Left 2
SYMATTR InstName C1
SYMATTR Value 10p
SYMBOL cap 1296 352 R0
WINDOW 0 38 20 Left 2
WINDOW 3 40 46 Left 2
SYMATTR InstName C2
SYMATTR Value 10p
SYMBOL cap 496 352 R0
WINDOW 0 37 20 Left 2
WINDOW 3 36 45 Left 2
SYMATTR InstName C3
SYMATTR Value 10p

comptof.asc, the sub-circuit schematic file:
Version 4
SHEET 1 880 680
WIRE 64 192 -16 192
WIRE 224 192 144 192
WIRE -304 336 -368 336
WIRE -128 336 -176 336
WIRE 32 336 -48 336
WIRE -304 368 -304 336
WIRE 32 368 32 336
WIRE -176 384 -176 336
WIRE -304 496 -304 448
WIRE -176 496 -176 448
WIRE -176 496 -304 496
WIRE 32 496 32 448
WIRE 32 496 -176 496
WIRE 32 528 32 496
FLAG -16 192 NINV
IOPIN -16 192 In
FLAG 224 192 HYS
FLAG 32 528 0
FLAG -176 336 OUT
IOPIN -176 336 Out
FLAG -368 336 INV
IOPIN -368 336 In
SYMBOL bv 160 192 R90
WINDOW 0 -32 56 VBottom 2
WINDOW 3 32 56 VTop 2
SYMATTR InstName B1
SYMATTR Value V=IF(V(out) > ({VHIGH}+{VLOW})/2,{VHYS},0)
SYMBOL bv 32 352 R0
WINDOW 0 40 40 Left 2
WINDOW 3 42 70 Left 2
SYMATTR InstName B2
SYMATTR Value V=IF(V(HYS,INV)>0,{VHIGH},{VLOW})
SYMBOL res -32 320 R90
WINDOW 0 0 56 VBottom 2
WINDOW 3 32 56 VTop 2
SYMATTR InstName R1
SYMATTR Value 10
SYMBOL cap -192 384 R0
SYMATTR InstName C1
SYMATTR Value 10p
SYMBOL res -320 352 R0
SYMATTR InstName R2
SYMATTR Value 1Meg

The netlist it stands for:
* 3-phase Vienna PFC with switches - load step.asc
Va a N SINE(0 {Vgpeak} {FLINE})
Vb b N SINE(0 {Vgpeak} {FLINE} 0 0 120)
Vc c N SINE(0 {Vgpeak} {FLINE} 0 0 240)
R1 N 0 1G
rla N013 N017 10m
rlb N015 N018 10m
rlc N016 N019 10m
H1 ia 0 VIa 60m
H2 ib 0 VIb 60m
H3 ic 0 VIc 60m
La N001 N013 800µ
Lb N006 N015 800µ
Lc N008 N016 800µ
VIa a N017 0
VIb b N018 0
VIc c N019 0
Sa2 Vo_2 N002 da 0 TOFSW
Sa1 N002 N001 da 0 TOFSW
C1 Vout N005 2m IC=400
R2 N005 Vo_2 10m
R4 Vout FB {Rupper}
R5 FB 0 {Rlower}
E1 va 0 a N 1
E2 vb 0 b N 1
E3 vc 0 c N 1
XX1 va vb vc theta theta_sub  ; pins Va Vb Vc theta
XX2 ia ib ic theta N030 N028 N032 dq0_sub  ; pins Ia Ib Ic theta I0 Id Iq
R6 N020 N021 {R2V}
C2 N021 FB {C1V}
C3 N020 FB {C2V}
R7 N026 N029 {R2d}
C4 N029 N025 {C1d}
C6 N026 N025 {C2d}
R8 0 N030 1Meg
R9 N026 N028 {Rdd}
R10 N034 N035 {R2q}
C5 N035 N031 {C1q}
C7 N034 N031 {C2q}
R11 N034 N032 {Rdq}
XX3 N025 N031 theta 0 Da1 Db1 Dc1 inverse_dq0 params: CLP=2.9 CLN=-2.9
V4 N022 0 PULSE(-3 3 0 16.6u 16.6u 1p 33.33u)
R12 theta 0 1Meg
XX7 N022 N024 da comptof params: VHIGH=5 VLOW=100m VHYS=10m
XX8 N022 N027 db comptof params: VHIGH=5 VLOW=100m VHYS=10m
XX9 N022 N033 dc comptof params: VHIGH=5 VLOW=100m VHYS=10m
XX10 FB N023 N020 opampTOF params: VHIGH=5 VLOW=100m  ; pins - + OUT
XX11 N026 N020 N025 opampTOF params: VHIGH=5 VLOW=-5  ; pins - + OUT
XX12 N034 0 N031 opampTOF params: VHIGH=5 VLOW=-5  ; pins - + OUT
R13 Vout Vo_2 {RL*2}
D1 N001 Vout TOFD
D2 0 N001 TOFD
D3 N006 Vout TOFD
D4 0 N006 TOFD
D5 N008 Vout TOFD
D6 0 N008 TOFD
D7 N002 N001 TOFD
D8 N002 Vo_2 TOFD
Sa3 Vo_2 N007 db 0 TOFSW
Sa4 N007 N006 db 0 TOFSW
D9 N007 N006 TOFD
D10 N007 Vo_2 TOFD
Sa5 Vo_2 N009 dc 0 TOFSW
Sa6 N009 N008 dc 0 TOFSW
D11 N009 N008 TOFD
D12 N009 Vo_2 TOFD
C8 Vo_2 N012 2m IC=400
R3 N012 0 10m
R14 Vo_2 0 {RL*2}
B1 N024 0 V=3-abs(V(Da1))
B2 N027 0 V=3-abs(V(Db1))
B3 N033 0 V=3-abs(V(Dc1))
E4 N014 0 Vout Vo_2 1
R15 Vlower Vo_2 1k
C9 0 Vlower 100n
R16 Vupper N014 1k
C10 0 Vupper 100n
StepSW1 Vo_2 N003 N004 0 TOFSW
R17 Vout N003 {RL*2}
V1 N004 0 PWL(0 0 330m 0 330.01m 5 480m 5 480.01m 0)
StepSW2 0 N010 N011 0 TOFSW
R18 Vo_2 N010 {RL*2}
V2 N011 0 PWL(0 0 330m 0 330.01m 5 480m 5 480.01m 0)
V5 N023 0 PWL(0 0 20m {Vref})

* block symbol definitions
.subckt inverse_dq0 d q theta zero Ia Ib Ic
R1 d 0 1Meg
R2 q 0 1Meg
R3 zero 0 1Meg
B1 IaC 0 V=((sin(V(theta))*V(d))+(cos(V(theta))*V(q))+(V(zero)/sqrt(2)))*sqrt(2/3)
B2 IbC 0 V=((sin(V(theta)-2*pi/3)*V(d))+(cos(V(theta)-2*pi/3)*V(q))+(V(zero)/sqrt(2)))*sqrt(2/3)
R4 theta 0 1Meg
B3 IcC 0 V=((sin(V(theta)+2*pi/3)*V(d))+(cos(V(theta)+2*pi/3)*V(q))+(V(zero)/sqrt(2)))*sqrt(2/3)
B4 N001 0 V=IF(V(IaC)>{CLP},{CLP},IF(V(Iac)<{CLN},{CLN},V(IaC)))
B5 N002 0 V=IF(V(IbC)>{CLP},{CLP},IF(V(Ibc)<{CLN},{CLN},V(IbC)))
B6 N003 0 V=IF(V(IcC)>{CLP},{CLP},IF(V(IcC)<{CLN},{CLN},V(IcC)))
R5 Ia N001 1k
R6 Ic N003 1k
R7 Ib N002 1k
C1 Ia 0 10p
C2 Ic 0 10p
C3 Ib 0 10p
.ends inverse_dq0

.subckt comptof INV NINV OUT
B1 HYS NINV V=IF(V(out) > ({VHIGH}+{VLOW})/2,{VHYS},0)
B2 N001 0 V=IF(V(HYS,INV)>0,{VHIGH},{VLOW})
R1 N001 OUT 10
C1 OUT 0 10p
R2 INV 0 1Meg
.ends comptof

.model D D
.lib standard.dio
*
.PARAM Fline=50
.param Vgrms=120
.PARAM Vgpeak={Vgrms*sqrt(2)}
.PARAM Vamp={Vgpeak*2}
.MODEL TOFSW SW(Ron=25m Roff=10Meg Vt=2 Vh=1)
.MODEL TOFD D(IS=10e-18 RS=16m CJO=450p
+M=0.4 VJ=0.75 ISR=720n BV=1000 IBV=100u TT=130n)
*
.tran 0 600m 300m uic
.param GfcV=35 ; magnitude at crossover *
.param PSV=-62 ; phase lag at crossover *
*
* Enter Design Goals Information Here *
*
.param fcV=10 ; targeted crossover *
.param PMV=60 ; choose phase margin at crossover *
*
* Enter the Values for Vout and Bridge Bias Current *
*
.param Vout=800
.param Pout=10k ; nominal is 5 kW
.param RL={(Vout/2)**2/(Pout/2)}
.param Ibias=100u
.param Vref=2.5
.param Rlower={Vref/Ibias}
.param Rupper={(Vout-Vref)/Ibias}
*
* Do not edit the below lines *
.param boostV={PMV-PSV-90}
.param GV={10**(-GfcV/20)}
.param kV={tan((boostV/2+45)*pi/180)}
.param fpV={fcV*kV}
.param fzV={fcV/kV}
.param C2V={1/(2*pi*fcV*GV*kV*Rupper)}
.param C1V={C2V*(kV**2-1)}
.param R2V={kV/(C1V*2*pi*fcV)}
*
* Components for the d loop *
.param Gfcd=-1.2 ; magnitude at crossover *
.param PSd=-93 ; phase lag at crossover *
*
* Enter Design Goals Information Here *
*
.param fcd=1k ; targeted crossover *
.param PMd=60 ; choose phase margin at crossover *
*
* Enter the Values for Vout and Bridge Bias Current *
*
.param Rdd=100k
*
* Do not edit the below lines *
.param boostd={PMd-PSd-90}
.param Gd={10**(-Gfcd/20)}
.param kd={tan((boostd/2+45)*pi/180)}
.param fpd={fcd*kd}
.param fzd={fcd/kd}
.param C2d={1/(2*pi*fcd*Gd*kd*Rdd)}
.param C1d={C2d*(kd**2-1)}
.param R2d={kd/(C1d*2*pi*fcd)}
*
* Components for the q loop *
.param Gfcq=-1.2 ; magnitude at crossover *
.param PSq=-93 ; phase lag at crossover *
*
* Enter Design Goals Information Here *
*
.param fcq=1k ; targeted crossover *
.param PMq=60 ; choose phase margin at crossover *
*
.param Rdq=100k
*
* Do not edit the below lines *
.param boostq={PMq-PSq-90}
.param Gq={10**(-Gfcq/20)}
.param kq={tan((boostq/2+45)*pi/180)}
.param fpq={fcq*kq}
.param fzq={fcq/kq}
.param C2q={1/(2*pi*fcq*Gq*kq*Rdq)}
.param C1q={C2d*(kq**2-1)}
.param R2q={kq/(C1q*2*pi*fcq)}
*
.four 50 10 -1 I(Via)
.four 50 10 -1 I(Vib)
.four 50 10 -1 I(Vic)
.options abstol=1u vntol=1m reltol=0.01 gmin=100p
+method=gear
.backanno
.end